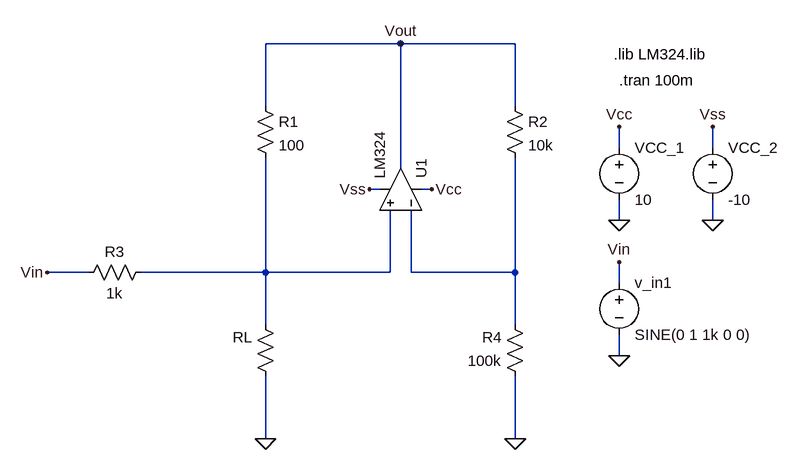
[diagram p0: schematic Lab1_Circuito2.asc]
Lab1_Circuito2.asc, the LTspice schematic file:
Version 4
SHEET 1 1124 680
WIRE 496 -224 288 -224
WIRE 672 -224 496 -224
WIRE 288 -128 288 -224
WIRE 672 -128 672 -224
WIRE 832 -64 832 -96
WIRE 976 -64 976 -96
WIRE 496 -32 496 -224
WIRE 464 0 448 0
WIRE 544 0 528 0
WIRE 832 48 832 16
WIRE 976 48 976 16
WIRE 16 128 -48 128
WIRE 288 128 288 -48
WIRE 288 128 96 128
WIRE 480 128 480 32
WIRE 480 128 288 128
WIRE 512 128 512 32
WIRE 672 128 672 -48
WIRE 672 128 512 128
WIRE 832 144 832 112
WIRE 288 208 288 128
WIRE 672 208 672 128
WIRE 832 256 832 224
WIRE 288 384 288 288
WIRE 672 384 672 288
FLAG 832 256 0
FLAG 832 112 Vin
FLAG 288 384 0
FLAG 672 384 0
FLAG -48 128 Vin
FLAG 448 0 Vss
FLAG 544 0 Vcc
FLAG 496 -224 Vout
FLAG 832 48 0
FLAG 832 -96 Vcc
FLAG 976 48 0
FLAG 976 -96 Vss
SYMBOL OpAmps\\opamp2 560 0 M270
SYMATTR InstName U1
SYMATTR Value LM324
SYMBOL voltage 832 128 R0
WINDOW 123 0 0 Left 0
WINDOW 39 0 0 Left 0
SYMATTR InstName v_in1
SYMATTR Value SINE(0 1 1k 0 0)
SYMBOL res 272 -144 R0
SYMATTR InstName R1
SYMATTR Value 100
SYMBOL res 656 -144 R0
SYMATTR InstName R2
SYMATTR Value 10k
SYMBOL res 112 112 R90
WINDOW 0 0 56 VBottom 2
WINDOW 3 32 56 VTop 2
SYMATTR InstName R3
SYMATTR Value 1k
SYMBOL res 688 304 R180
WINDOW 0 36 76 Left 2
WINDOW 3 36 40 Left 2
SYMATTR InstName R4
SYMATTR Value 100k
SYMBOL res 304 304 R180
WINDOW 0 36 76 Left 2
WINDOW 3 36 40 Left 2
SYMATTR InstName RL
SYMATTR Value ""
SYMBOL voltage 832 -80 R0
WINDOW 123 0 0 Left 0
WINDOW 39 0 0 Left 0
SYMATTR InstName VCC_1
SYMATTR Value 10
SYMBOL voltage 976 -80 R0
WINDOW 123 0 0 Left 0
WINDOW 39 0 0 Left 0
SYMATTR InstName VCC_2
SYMATTR Value -10
TEXT 824 -208 Left 2 !.lib LM324.lib
TEXT 832 -168 Left 2 !.tran 100m

The netlist it stands for:
* Lab1_Circuito2.asc
XU1 N001 N002 Vcc Vss Vout LM324  ; pins In+ In- V+ V- OUT
v_in1 Vin 0 SINE(0 1 1k 0 0)
R1 Vout N001 100
R2 Vout N002 10k
R3 N001 Vin 1k
R4 0 N002 100k
RL 0 N001
VCC_1 Vcc 0 10
VCC_2 Vss 0 -10
.lib LM324.lib
.tran 100m
.backanno
.end